# EAGLE schematic treiber (EAGLE 6.4)
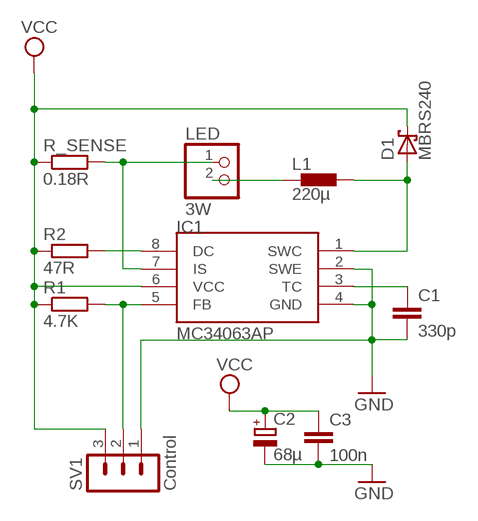
[diagram p0: schematic, sheet 1]

## Parts
C1  330p  C-EU075-032X103  [C075-032X103]
C2  68µ  CPOL-EUE2.5-5  [E2,5-5]
C3  100n  C5/2.5  [C5B2.5]
D1  MBRS240  SCHOTTKY-DIODEDO35-7  [DO35-7]
IC1  MC34063AP  [DIL08]
L1  220µ  DR1030  [DR1030]
LED  3W  PINHD-1X2  [1X02]
R1  4.7K  R-EU_0207/10  [0207/10]
R2  47R  R-EU_0207/10  [0207/10]
R_SENSE  0.18R  R-EU_0207/10  [0207/10]
SV1  Control  MA03-1  [MA03-1]

## Nets
GND: C1.2 C2.- C3.2 IC1.2(SWE) IC1.4(GND) SV1.1
N$1: C1.1 IC1.3(TC)
N$2: IC1.8(DC) R2.2
N$3: IC1.7(IS) LED.1 R_SENSE.2
N$4: L1.1 LED.2
N$5: D1.A IC1.1(SWC) L1.2
PWM: IC1.5(FB) R1.2 SV1.2
VCC: C2.+ C3.1 D1.C IC1.6(VCC) R1.1 R2.1 R_SENSE.1 SV1.3

## Library data of the parts
C1 = resistor:C-EU: CAPACITOR, European symbol
C2 = resistor:CPOL-EU: POLARIZED CAPACITOR, European symbol
C3 = capacitor-wima:C: CAPACITOR naming: grid - package width
D1 = diode:SCHOTTKY-DIODE: Schottky Diode
IC1 = mc34063:MC34063
L1 = inductors:DR1030: DR1030 Series Low Profile Power Inductors Source: Data sheet <http://www.cooperbussmann.com/pdf/c73e479f-f867-4c64-ae26-9c1f23814163.pdf>
LED = pinhead:PINHD-1X2: PIN HEADER
R1 R2 R_SENSE = resistor:R-EU_: RESISTOR, European symbol
SV1 = con-lstb:MA03-1: PIN HEADER; OC_FARNELL: unknown; OC_NEWARK: unknown